# EAGLE design TinySmps (EAGLE 9.1.3)
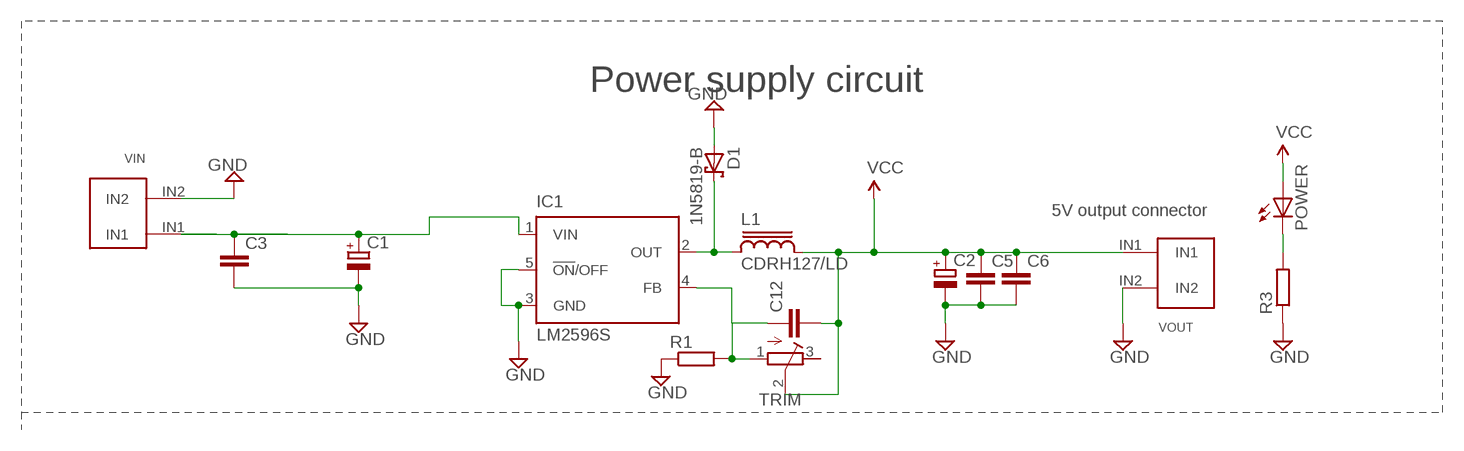
[diagram p0: schematic, sheet 1]

## Parts
C1  CPOL-EUE5-10.5  [E5-10,5]
C2  CPOL-EUE5-10.5  [E5-10,5]
C3  C-EUC1206  [C1206]
C5  C-EUC1206  [C1206]
C6  C-EUC1206  [C1206]
C12  C2,5-3  [C2.5-3]
D1  1N5819-B  [DO41-7.6]
IC1  LM2596S  [TO263-5]
L1  CDRH127/LD  [CDRH127/LD]
POWER  LEDSML0805  [SML0805]
R1  R-EU_0204/7  [0204/7]
R3  R-EU_R1206  [R1206]
TRIM  R-TRIMM3296W  [RTRIM3296W]
VIN  1X2_5MM  [1X2_5MM]
VOUT  1X2_5MM  [1X2_5MM]

## Nets
GND: C1.- C2.- C3.2 C5.2 C6.2 D1.A IC1.3(GND) IC1.5(!ON!/OFF) R1.1 R3.1 VIN.IN2 VOUT.IN2
IN: C1.+ C3.1 IC1.1(VIN) VIN.IN1
N$1: POWER.C R3.2
N$2: D1.C IC1.2(OUT) L1.1
N$3: C12.1 IC1.4(FB) R1.2 TRIM.1(A)
VCC: C2.+ C5.1 C6.1 C12.2 L1.2 POWER.A TRIM.2(S) VOUT.IN1
Unconnected: TRIM.3(E)

## Notes on the sheet
- Power supply circuit
- 5V output connector

## Library data of the parts
C1 C2 = resistor:CPOL-EU: POLARIZED CAPACITOR, European symbol
C3 C5 C6 = rcl:C-EU: CAPACITOR, European symbol
C12 = capacitor-wima:C: CAPACITOR naming: grid - package width
D1 = diode:1N581*: 1.0A SCHOTTKY BARRIER RECTIFIER Source: http://www.diodes.com/datasheets/ds23001.pdf
IC1 = national-semiconductor:LM2596: SIMPLE SWITCHER® Power Converter 150 kHz 3A Step-Down Voltage Regulator Source: http://www.national.com/ds/LM/LM2596.pdf; MF: NATIONAL SEMICONDUCTOR; MPN: LM2596S-ADJ/NOPB; OC_FARNELL: 9494367; OC_NEWARK: 41K3842
L1 = inductor-sumida:CDRH127/LD: Power Inductor
POWER = led:LED: LED OSRAM: - CHIPLED LG R971, LG N971, LY N971, LG Q971, LY Q971, LO R971, LY R971 LH N974, LH R974 LS Q976, LO Q976, LY Q976 LO Q996 - Hyper CHIPLED LW Q18S LB Q993, LB Q99A, LB R99A - SideLED LS A670, LO A670, LY A670, LG A670, LP A670 LB A673, LV A673, LT A673, LW A673 LH A674 LY A675 LS A676, LA A676, LO A676, LY A676, LW A676 LS A679, LY A679, LG A679 - Hyper Micro SIDELED® LS Y876, LA Y876, LO Y876, LY Y876 LT Y87S - SmartLED LW L88C, LW L88S LB L89C, LB L89S, LG L890 LS L89K, LO L89K, LY L89K LS L896, LA L896, LO L896, LY L896 - TOPLED LS T670, LO T670, LY T670, LG T670, LP T670 LSG T670, LSP T670, LSY T670, LOP T670, LYG T670 LG T671, LOG T671, LSG T671 LB T673, LV T673, LT T673, LW T673 LH T674 LS T676, LA T676, LO T676, LY T676, LB T676, LH T676, LSB T676, LW T676 LB T67C, LV T67C, LT T67C, LS T67K, LO T67K, LY T67K, LW E67C LS E67B, LA E67B, LO E67B, LY E67B, LB E67C, LV E67C, LT E67C LW T67C LS T679, LY T679, LG T679 LS T770, LO T770, LY T770, LG T770, LP T770 LB T773, LV T773, LT T773, LW T773 LH T774 LS E675, LA E675, LY E675, LS T675 LS T776, LA T776, LO T776, LY T776, LB T776 LHGB T686 LT T68C, LB T68C - Hyper Mini TOPLED® LB M676 - Mini TOPLED Santana® LG M470 LS M47K, LO M47K, LY M47K Source: http://www.osram.convergy.de LUXEON: - LUMILED® LXK2-PW12-R00, LXK2-PW12-S00, LXK2-PW14-U00, LXK2-PW14-V00 LXK2-PM12-R00, LXK2-PM12-S00, LXK2-PM14-U00 LXK2-PE12-Q00, LXK2-PE12-R00, LXK2-PE12-S00, LXK2-PE14-T00, LXK2-PE14-U00 LXK2-PB12-K00, LXK2-PB12-L00, LXK2-PB12-M00, LXK2-PB14-N00, LXK2-PB14-P00, LXK2-PB14-Q00 LXK2-PR12-L00, LXK2-PR12-M00, LXK2-PR14-Q00, LXK2-PR14-R00 LXK2-PD12-Q00, LXK2-PD12-R00, LXK2-PD12-S00 LXK2-PH12-R00, LXK2-PH12-S00 LXK2-PL12-P00, LXK2-PL12-Q00, LXK2-PL12-R00 Source: www.luxeon.com KINGBRIGHT: KA-3528ASYC Source: www.kingbright.com
R1 = rcl:R-EU_: RESISTOR, European symbol
R3 = resistor:R-EU_: RESISTOR, European symbol
TRIM = resistor:R-TRIMM: Trimm resistor
VIN VOUT = doru_terminal_block:1X2_5MM

## Board
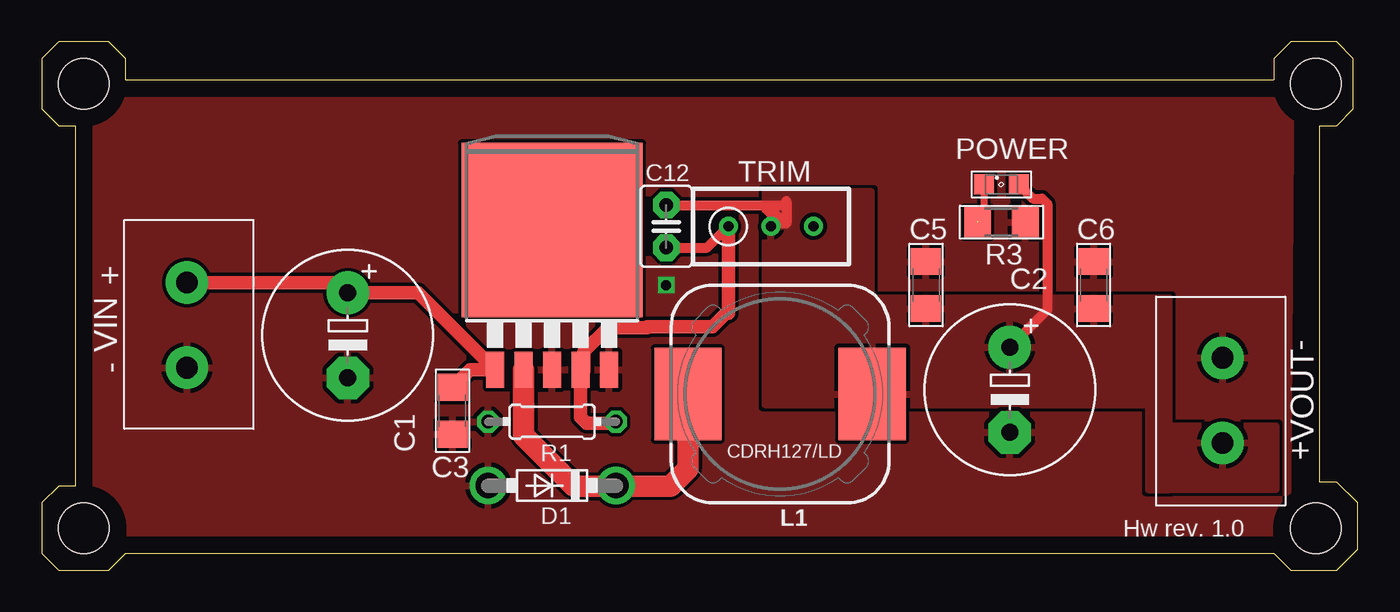
[diagram p1: board, top side]
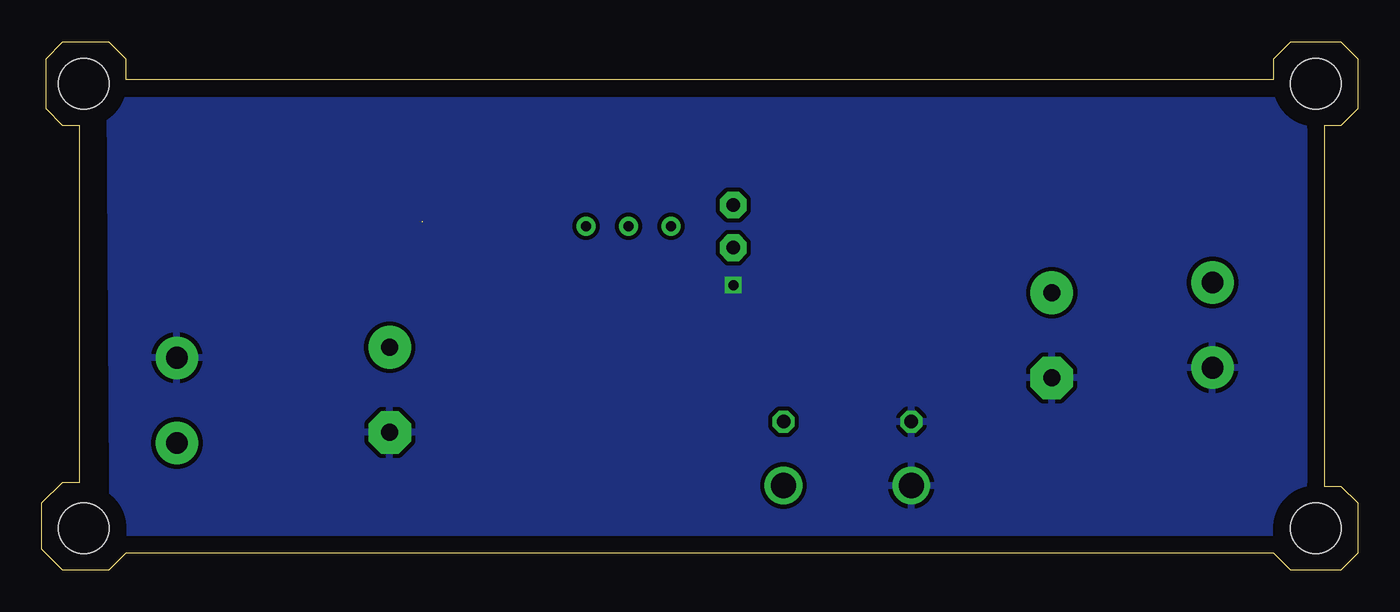
[diagram p2: board, bottom side, seen from below]

Size 78.5 x 31.5 mm. Coordinates in mm from the lower left corner, seen from the top.
Outline: 5,29.25 5,30.5 4,31.5 1,31.5 0,30.5 0,27.5 1,26.5 2,26.5 2,5 1,5 0,4 0,1 1,0 4,0 5,1 73.5,1 74.5,0 77.25,0 78.5,1.25 78.5,4 77.25,5.25 76.25,5.25 76.25,26.5 77.25,26.5 78.25,27.5 78.25,30.5 77.25,31.5 74.5,31.5 73.5,30.5 73.5,29.25 5,29.25
Copper layers (1*16): Top 0.035mm / dielectric 1.5mm / Bottom 0.035mm
Design rules "default *": minimum track width 10mil, minimum drill 24mil, track to track 8mil, track to pad 8mil, pad to pad 8mil, via to via 8mil, smd to smd 8mil, copper to edge 40mil, drill to drill 8mil, minimum pad ring 10mil, minimum via ring 8mil, stop-mask expansion 4mil, vias tented up to drill 0mil, thermal gap 10mil
Holes 3 mm at 2.5,29 76,29 76,2.5 2.5,2.5

### Footprints (pad centres in the part's own frame; a part is rotated, then mirrored left to right if it is on the bottom)
E5-10,5 = drill 1.016 pad 2.54: + -2.54,0 | drill 1.016 pad 2.54 octagon: - 2.54,0
C1206 = smd 1.6 x 1.8: 1 -1.4,0; 2 1.4,0
C2.5-3 = drill 0.813 pad 1.6 octagon: 1 -1.27,0; 2 1.27,0
DO41-7.6 = drill 1.5 pad 2.184: A 3.81,0; C -3.81,0
TO263-5 = smd 1.067 x 2.159: 1 -3.404,-5.791; 2 -1.702,-5.791; 3 0,-5.791; 4 1.702,-5.791; 5 3.404,-5.791 | smd 10.8 x 10.41: 6 0,2.54
CDRH127/LD = smd 4 x 5.5: 1 -5.5,0; 2 5.5,0
SML0805 = smd 1.2 x 1.2: A 1.05,0; C -1.05,0
0204/7 = drill 0.813 octagon: 1 -3.81,0; 2 3.81,0
R1206 = smd 1.6 x 1.803: 1 -1.422,0; 2 1.422,0
RTRIM3296W = drill 0.61: 1 0,-2.54; 2 0,0; 3 0,2.54
1X2_5MM = drill 1.3 pad 2.54: IN1 0,0; IN2 5.08,0

### Placement (x,y rotation side)
C1  18.25,14 270 top
C2  57.75,10.75 270 top
C3  24.5,9.5 270 top
C5  52.75,17 90 top
C6  62.75,17 90 top
C12  37.25,20.5 90 top
D1  30.44,5.04 180 top
IC1  30.44,17.74 0 top
L1  44.04,10.5 0 top
POWER  57.25,23 0 top
R1  30.44,8.85 0 top
R3  57.25,20.75 180 top
TRIM  43.5,20.5 270 top
VIN  8.65,17.15 270 top
VOUT  70.44,7.58 90 top

### Tracks (layer width: path | path; a pad name or v marks a point on that pad's centre or on a via)
GND  (via drill 0.6)
  other vias: 37.25,17
  pour Top (rank 6): 2.5,29.77 74.51,29.77 74.31,0.75 2.5,0.75
  pour Bottom (isolate 0.254, rank 6): 2.5,28.1 74.46,28.1 74.28,0.75 2.5,0.75
IN
  Top 0.813: VIN.IN1 17.64,17.15 C1.+ 22.45,16.54 IC1.1 25.55,11.95 C3.1
N$1  (1 unrouted)
  Top 0.406: POWER.C 56.2,20.87 55.83,20.81
N$2
  Top 1.27: IC1.2 28.74,8.01 31.75,5 34.21,5 D1.C 34.29,5 37.5,5 38.54,6.04 L1.1
  Top 1.422: 39.33,8.6 39.33,9.46 L1.1
N$3
  Top 0.61: C12.1 39.69,19.23 TRIM.1
  Top 0.813: TRIM.1 40.96,15.31 40.81,15.31 40,14.5 36.13,14.5 36.09,14.46 33.77,14.46 32.34,13.04 32.34,11.9 IC1.4 32.14,9.11 32.5,8.75 34.15,8.75 R1.2
VCC
  Top 0.61: 43.91,20.66 44.41,20.66 44.41,21 44.41,22 44.18,21.77 C12.2 | 43.91,20.66 TRIM.2 | 43.23,21.52 43.5,21.25 43.75,21.25 43.91,21.09 43.91,20.66 | POWER.A 59.14,22.16 59.68,22.16 59.98,21.86 59.98,15.52 C2.+
  pour Top (isolate 0.254): 43.14,9.87 66,9.87 66,4.79 67.27,4.79 67.27,16.22 49.49,16.22 49.49,22.57 43.14,22.57
  pour Top (isolate 0.254): 67.27,8.6 73.62,8.6 73.62,4.79 67.27,4.79

### Text on the board
tPlace: Hw rev. 1.0
tNames: + | - | - | +